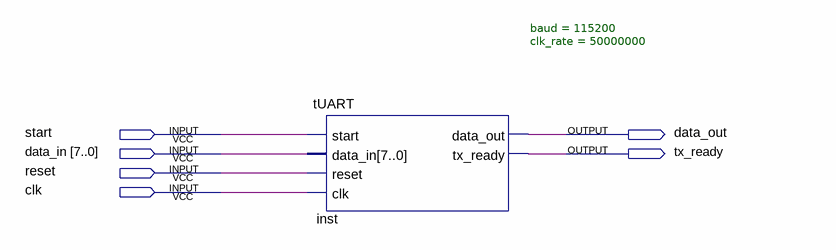
[diagram p0: schematic sheet]
// Quartus schematic transmission.bdf as structural Verilog: 1 symbols, 6 pins
module transmission (
  input  start,
  input  [7:0] data_in,
  input  reset,
  input  clk,
  output data_out,
  output tx_ready
);

  tUART #(.baud(115200), .clk_rate(50000000)) inst (
    .start(start), .data_in(data_in), .reset(reset), .clk(clk), .data_out(data_out), .tx_ready(tx_ready));
endmodule
